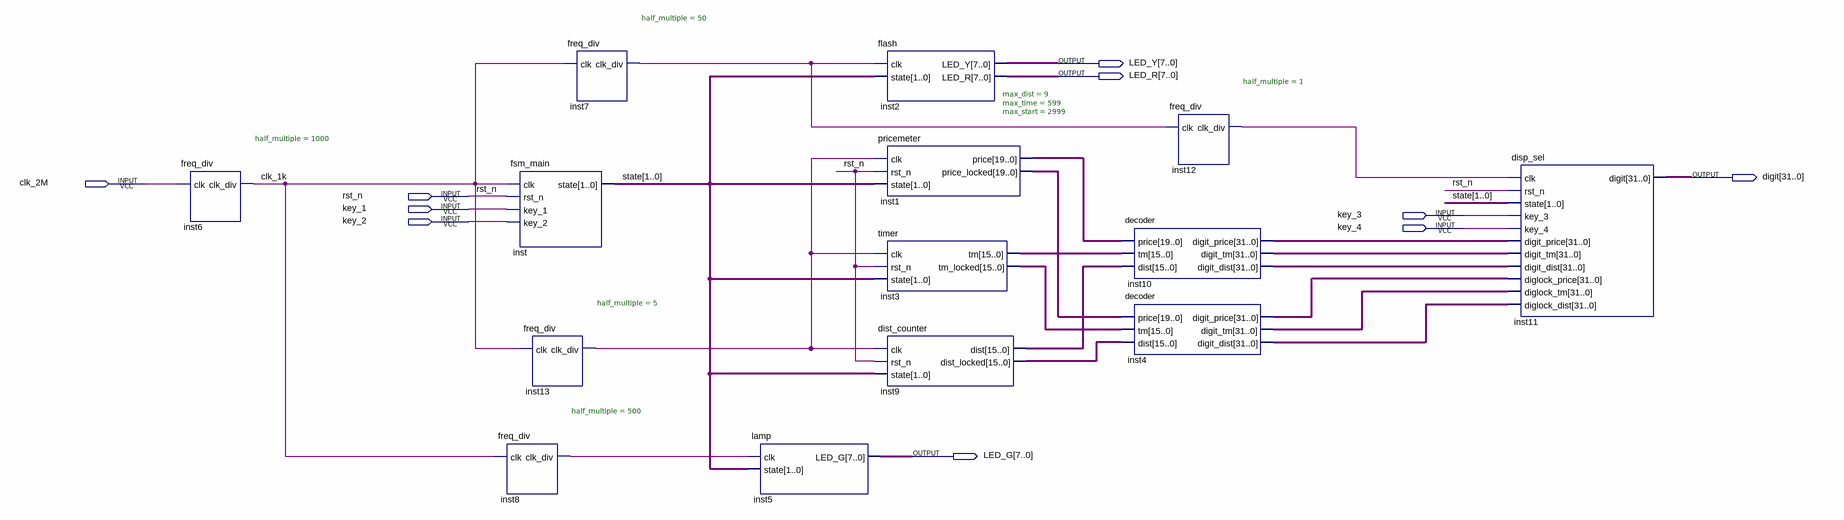
[diagram p0: schematic sheet]
// Quartus schematic taxi_controller.bdf as structural Verilog: 14 symbols, 10 pins
module taxi_controller (
  input  clk_2M,
  input  rst_n,
  input  key_1,
  input  key_3,
  input  key_2,
  input  key_4,
  output [7:0] LED_Y,
  output [7:0] LED_R,
  output [31:0] digit,
  output [7:0] LED_G
);

  wire clk_1k, inst7_clk_div, inst8_clk_div, inst12_clk_div, inst13_clk_div;
  wire [1:0] state;
  wire [15:0] inst3_tm, inst3_tm_locked, inst9_dist, inst9_dist_locked;
  wire [19:0] inst1_price, inst1_price_locked;
  wire [31:0] inst4_digit_dist, inst4_digit_price, inst4_digit_tm, inst10_digit_dist, inst10_digit_price,
       inst10_digit_tm;

  freq_div #(.half_multiple(1000)) inst6 (.clk(clk_2M), .clk_div(clk_1k));
  fsm_main inst (.clk(clk_1k), .rst_n(rst_n), .key_1(key_1), .key_2(key_2), .state(state));
  freq_div #(.half_multiple(5)) inst13 (.clk(clk_1k), .clk_div(inst13_clk_div));
  freq_div #(.half_multiple(500)) inst8 (.clk(clk_1k), .clk_div(inst8_clk_div));
  freq_div #(.half_multiple(50)) inst7 (.clk(clk_1k), .clk_div(inst7_clk_div));
  lamp inst5 (.clk(inst8_clk_div), .state(state), .LED_G(LED_G));
  flash inst2 (.clk(inst7_clk_div), .state(state), .LED_Y(LED_Y), .LED_R(LED_R));
  pricemeter #(.max_dist(9), .max_time(599), .max_start(2999)) inst1 (
    .clk(inst13_clk_div), .rst_n(rst_n), .state(state), .price(inst1_price), .price_locked(inst1_price_locked));
  timer inst3 (.clk(inst13_clk_div), .rst_n(rst_n), .state(state), .tm(inst3_tm), .tm_locked(inst3_tm_locked));
  dist_counter inst9 (
    .clk(inst13_clk_div), .rst_n(rst_n), .state(state), .\dist (inst9_dist), .dist_locked(inst9_dist_locked));
  decoder inst10 (
    .price(inst1_price), .tm(inst3_tm), .\dist (inst9_dist), .digit_price(inst10_digit_price),
    .digit_tm(inst10_digit_tm), .digit_dist(inst10_digit_dist));
  decoder inst4 (
    .price(inst1_price_locked), .tm(inst3_tm_locked), .\dist (inst9_dist_locked),
    .digit_price(inst4_digit_price), .digit_tm(inst4_digit_tm), .digit_dist(inst4_digit_dist));
  freq_div #(.half_multiple(1)) inst12 (.clk(inst7_clk_div), .clk_div(inst12_clk_div));
  disp_sel inst11 (
    .clk(inst12_clk_div), .rst_n(rst_n), .state(state), .key_3(key_3), .key_4(key_4),
    .digit_price(inst10_digit_price), .digit_tm(inst10_digit_tm), .digit_dist(inst10_digit_dist),
    .diglock_price(inst4_digit_price), .diglock_tm(inst4_digit_tm), .diglock_dist(inst4_digit_dist),
    .digit(digit));
endmodule
